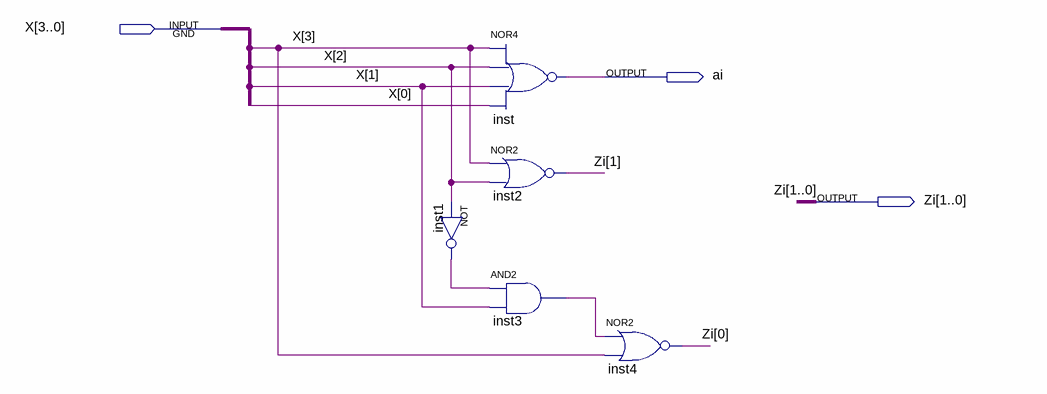
[diagram p0: schematic sheet]
// Quartus schematic Nib_Loc_Count.bdf as structural Verilog: 5 symbols, 3 pins
module Nib_Loc_Count (
  input  [3:0] X,
  output ai,
  output [1:0] Zi
);

  wire inst1_out, inst3_out;

  nor inst (ai, X[3], X[2], X[1], X[0]);
  nor inst2 (Zi[1], X[3], X[2]);
  not inst1 (inst1_out, X[2]);
  and inst3 (inst3_out, inst1_out, X[1]);
  nor inst4 (Zi[0], inst3_out, X[3]);
endmodule
